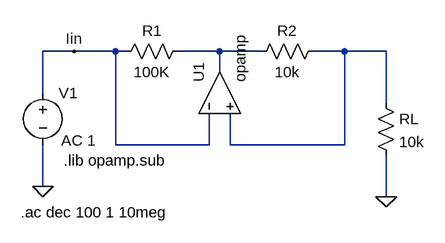
[diagram p0: schematic Ej_6.asc]
Ej_6.asc, the LTspice schematic file:
Version 4
SHEET 1 880 680
WIRE -208 96 -256 96
WIRE -144 96 -208 96
WIRE -128 96 -144 96
WIRE 16 96 -48 96
WIRE 80 96 16 96
WIRE 208 96 160 96
WIRE 272 96 208 96
WIRE 16 128 16 96
WIRE -256 160 -256 96
WIRE 272 176 272 96
WIRE -144 240 -144 96
WIRE 0 240 0 192
WIRE 0 240 -144 240
WIRE 32 240 32 192
WIRE 208 240 208 96
WIRE 208 240 32 240
WIRE -256 304 -256 240
WIRE 272 320 272 256
FLAG -256 304 0
FLAG 272 320 0
FLAG -208 96 Iin
SYMBOL voltage -256 144 R0
WINDOW 3 24 152 Left 2
WINDOW 123 28 89 Left 2
WINDOW 39 0 0 Left 0
SYMATTR Value ""
SYMATTR Value2 AC 1
SYMATTR InstName V1
SYMBOL OpAmps\\opamp -48 160 R270
SYMATTR InstName U1
SYMBOL res -32 80 R90
WINDOW 0 0 56 VBottom 2
WINDOW 3 32 56 VTop 2
SYMATTR InstName R1
SYMATTR Value 100K
SYMBOL res 176 80 R90
WINDOW 0 0 56 VBottom 2
WINDOW 3 32 56 VTop 2
SYMATTR InstName R2
SYMATTR Value 10k
SYMBOL res 256 160 R0
SYMATTR InstName RL
SYMATTR Value 10k
TEXT -224 264 Left 2 !.lib opamp.sub
TEXT -290 344 Left 2 !.ac dec 100 1 10meg

The netlist it stands for:
* Ej_6.asc
V1 Iin 0 AC 1
XU1 Iin N002 N001 opamp Aol=100K GBW=10Meg  ; pins invin noninvin out
R1 N001 Iin 100K
R2 N002 N001 10k
RL N002 0 10k
.lib opamp.sub
.ac dec 100 1 10meg
.backanno
.end